# EAGLE design swarm-agg1 (EAGLE 4.16)
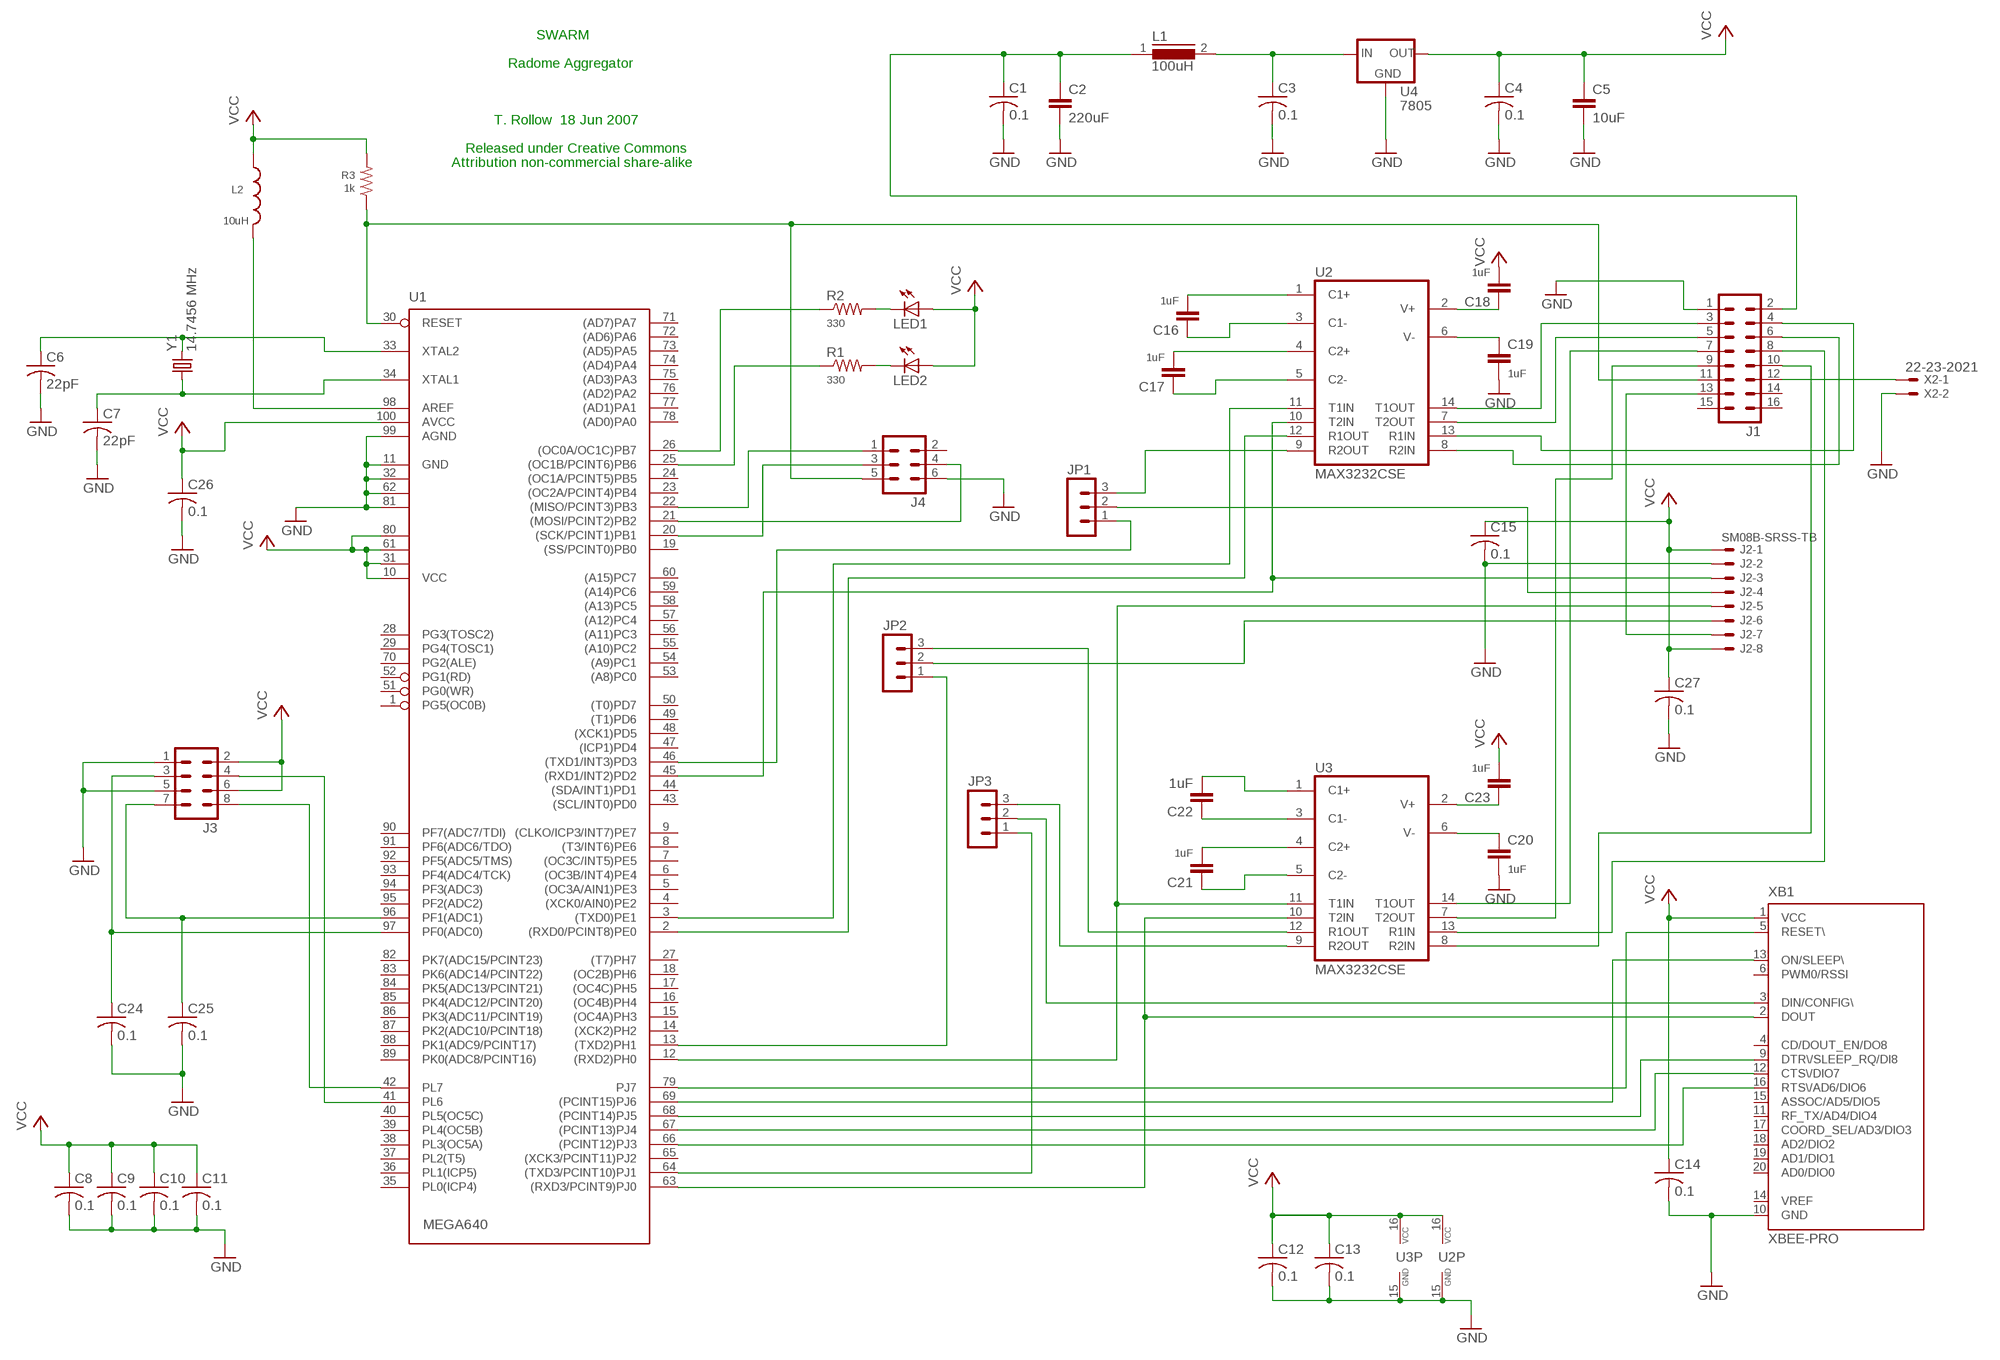
[diagram p0: schematic, sheet 1]

## Parts
C1  0.1  C-USC0805K  [C0805K]
C2  220uF  C2.5/5  [C2.5-5]
C3  0.1  C-USC0805K  [C0805K]
C4  0.1  C-USC0805K  [C0805K]
C5  10uF  C2.5/5  [C2.5-5]
C6  22pF  C-USC1206K  [C1206K]
C7  22pF  C-USC1206K  [C1206K]
C8  0.1  C-USC0805K  [C0805K]
C9  0.1  C-USC0805K  [C0805K]
C10  0.1  C-USC0805K  [C0805K]
C11  0.1  C-USC0805K  [C0805K]
C12  0.1  C-USC0805K  [C0805K]
C13  0.1  C-USC0805K  [C0805K]
C14  0.1  C-USC0805K  [C0805K]
C15  0.1  C-USC0805K  [C0805K]
C16  1uF  C-EUC1206  [C1206]
C17  1uF  C-EUC1206  [C1206]
C18  1uF  C-EUC1206  [C1206]
C19  1uF  C-EUC1206  [C1206]
C20  1uF  C-EUC1206  [C1206]
C21  1uF  C-EUC1206  [C1206]
C22  1uF  C-EUC1206  [C1206]
C23  1uF  C-EUC1206  [C1206]
C24  0.1  C-USC0805K  [C0805K]
C25  0.1  C-USC0805K  [C0805K]
C26  0.1  C-USC0805K  [C0805K]
C27  0.1  C-USC0805K  [C0805K]
J1  MA08-2  [MA08-2]
J2  SM08B-SRSS-TB  [SM08B-SRSS-TB]
J3  MA04-2  [MA04-2]
J4  MA03-2  [MA03-2]
JP1  MA03-1  [MA03-1]
JP2  MA03-1  [MA03-1]
JP3  MA03-1  [MA03-1]
L1  100uH  B82132  [SUKW2-22]
L2  10uH  L-USL1812  [L1812]
LED1  LEDSMT1206  [1206]
LED2  LEDSMT1206  [1206]
R1  330  R-US_M1206  [M1206]
R2  330  R-US_M1206  [M1206]
R3  1k  R-US_M1206  [M1206]
U1  MEGA640  [TQFP100]
U2  MAX3232CSE  [SO16]
U3  MAX3232CSE  [SO16]
U4  7805  78XXS  [78XXS]
X2  22-23-2021  [22-23-2021]
XB1  XBEE-PRO  [XBEE-PRO]
Y1  14.7456 MHz  CRYSTALHC49S  [HC49/S]

## Nets
GND: C1.2 C2.2 C3.2 C4.2 C5.2 C6.2 C7.2 C8.2 C9.2 C10.2 C11.2 C12.2 C13.2 C14.2 C15.2 C19.2 C20.2 C24.2 C25.2 C26.2 C27.2 J1.1 J2.2 J3.1 J3.5 J4.6 U1.11(GND) U1.32(GND1) U1.62(GND2) U1.81(GND3) U1.99(AGND) U2.15(GND) U3.15(GND) U4.GND X2.2 XB1.10(GND)
N$1: U1.3((TXD0)PE1) U2.11(T1IN)
N$3: C16.2 U2.1(C1+)
N$4: J1.3 U2.14(T1OUT)
N$5: J1.4 U2.13(R1IN)
N$6: J1.5 U2.7(T2OUT)
N$7: J1.6 U2.8(R2IN)
N$8: U1.2((RXD0/PCINT8)PE0) U2.12(R1OUT)
N$9: JP1.3 U2.9(R2OUT)
N$10: J2.3 U1.45((RXD1/INT2)PD2) U2.10(T2IN)
N$11: JP1.1 U1.46((TXD1/INT3)PD3)
N$12: J2.4 JP1.2
N$13: J1.7 U3.14(T1OUT)
N$14: J1.8 U3.13(R1IN)
N$15: J2.5 U1.12((RXD2)PH0) U3.11(T1IN)
N$16: C3.1 L1.2 U4.IN
N$17: C1.1 C2.1 J1.2 L1.1
N$18: C24.1 J3.3 U1.97(PF0(ADC0))
N$19: C25.1 J3.7 U1.96(PF1(ADC1))
N$20: J1.9 U3.7(T2OUT)
N$21: J1.10 U3.8(R2IN)
N$22: J2.6 JP2.2
N$23: JP2.3 U3.12(R1OUT)
N$24: JP3.3 U3.9(R2OUT)
N$25: U1.63((RXD3/PCINT9)PJ0) U3.10(T2IN) XB1.2(DOUT)
N$26: JP3.1 U1.64((TXD3/PCINT10)PJ1)
N$27: JP3.2 XB1.3(DIN/CONFIG\)
N$28: JP2.1 U1.13((TXD2)PH1)
N$29: C6.1 U1.33(XTAL2) Y1.2
N$30: J4.1 U1.22((MISO/PCINT3)PB3)
N$31: J4.3 U1.20((SCK/PCINT1)PB1)
N$32: J1.12 X2.1
N$33: J1.11 J4.5 R3.1 U1.30(RESET)
N$34: J4.4 U1.21((MOSI/PCINT2)PB2)
N$35: C7.1 U1.34(XTAL1) Y1.1
N$36: J3.4 U1.41(PL6)
N$37: J3.8 U1.42(PL7)
N$38: C16.1 U2.3(C1-)
N$39: C17.2 U2.4(C2+)
N$40: C17.1 U2.5(C2-)
N$41: C19.1 U2.6(V-)
N$42: C18.1 U2.2(V+)
N$43: C23.1 U3.2(V+)
N$44: C20.1 U3.6(V-)
N$45: C21.1 U3.5(C2-)
N$46: C21.2 U3.4(C2+)
N$47: C22.1 U3.3(C1-)
N$48: C22.2 U3.1(C1+)
N$49: L2.2 U1.98(AREF)
N$50: LED2.C R1.2
N$51: R1.1 U1.25((OC1B/PCINT6)PB6)
N$52: LED1.C R2.2
N$53: R2.1 U1.26((OC0A/OC1C)PB7)
N$54: U1.79(PJ7) XB1.5(RESET\)
N$55: U1.69((PCINT15)PJ6) XB1.13(ON/SLEEP\)
N$56: U1.68((PCINT14)PJ5) XB1.9(DTR\/SLEEP_RQ/DI8)
N$57: U1.67((PCINT13)PJ4) XB1.12(CTS\/DIO7)
N$58: U1.66((PCINT12)PJ3) XB1.16(RTS\/AD6/DIO6)
N$59: J1.13 J2.7
VCC: C4.1 C5.1 C8.1 C9.1 C10.1 C11.1 C12.1 C13.1 C14.1 C15.1 C18.2 C23.2 C26.1 C27.1 J2.1 J2.8 J3.2 J3.6 L2.1 LED1.A LED2.A R3.2 U1.10(VCC) U1.31(VCC1) U1.61(VCC2) U1.80(VCC3) U1.100(AVCC) U2.16(VCC) U3.16(VCC) U4.OUT XB1.1(VCC)
Unconnected: J1.14 J1.15 J1.16 J4.2 U1.1(PG5(OC0B)) U1.4((XCK0/AIN0)PE2) U1.5((OC3A/AIN1)PE3) U1.6((OC3B/INT4)PE4) U1.7((OC3C/INT5)PE5) U1.8((T3/INT6)PE6) U1.9((CLKO/ICP3/INT7)PE7) U1.14((XCK2)PH2) U1.15((OC4A)PH3) U1.16((OC4B)PH4) U1.17((OC4C)PH5) U1.18((OC2B)PH6) U1.19((SS/PCINT0)PB0) U1.23((OC2A/PCINT4)PB4) U1.24((OC1A/PCINT5)PB5) U1.27((T7)PH7) U1.28(PG3(TOSC2)) U1.29(PG4(TOSC1)) U1.35(PL0(ICP4)) U1.36(PL1(ICP5)) U1.37(PL2(T5)) U1.38(PL3(OC5A)) U1.39(PL4(OC5B)) U1.40(PL5(OC5C)) U1.43((SCL/INT0)PD0) U1.44((SDA/INT1)PD1) U1.47((ICP1)PD4) U1.48((XCK1)PD5) U1.49((T1)PD6) U1.50((T0)PD7) U1.51(PG0(WR)) U1.52(PG1(RD)) U1.53((A8)PC0) U1.54((A9)PC1) U1.55((A10)PC2) U1.56((A11)PC3) U1.57((A12)PC4) U1.58((A13)PC5) U1.59((A14)PC6) U1.60((A15)PC7) U1.65((XCK3/PCINT11)PJ2) U1.70(PG2(ALE)) U1.71((AD7)PA7) U1.72((AD6)PA6) U1.73((AD5)PA5) U1.74((AD4)PA4) U1.75((AD3)PA3) U1.76((AD2)PA2) U1.77((AD1)PA1) U1.78((AD0)PA0) U1.82(PK7(ADC15/PCINT23)) U1.83(PK6(ADC14/PCINT22)) U1.84(PK5(ADC13/PCINT21)) U1.85(PK4(ADC12/PCINT20)) U1.86(PK3(ADC11/PCINT19)) U1.87(PK2(ADC10/PCINT18)) U1.88(PK1(ADC9/PCINT17)) U1.89(PK0(ADC8/PCINT16)) U1.90(PF7(ADC7/TDI)) U1.91(PF6(ADC6/TDO)) U1.92(PF5(ADC5/TMS)) U1.93(PF4(ADC4/TCK)) U1.94(PF3(ADC3)) U1.95(PF2(ADC2)) XB1.4(CD/DOUT_EN/DO8) XB1.6(PWM0/RSSI) XB1.11(RF_TX/AD4/DIO4) XB1.14(VREF) XB1.15(ASSOC/AD5/DIO5) XB1.17(COORD_SEL/AD3/DIO3) XB1.18(AD2/DIO2) XB1.19(AD1/DIO1) XB1.20(AD0/DIO0)

## Notes on the sheet
- SWARM
- Radome Aggregator
- T. Rollow  18 Jun 2007
- Released under Creative Commons
- Attribution non-commercial share-alike

## Library data of the parts
C1 C3 C4 C6-C15 C24-C27 = rcl:C-US: CAPACITOR, American symbol
C2 C5 = capacitor-wima:C: CAPACITOR naming: grid - package width
C16-C23 = rcl:C-EU: CAPACITOR, European symbol
J1 = con-lstb:MA08-2: PIN HEADER
J2 = con-jst2:?M08B-SRSS-TB: Disconnectable Crimp style connector, 1.0mm pitch 8 contacts
J3 = con-lstb:MA04-2: PIN HEADER
J4 = con-lstb:MA03-2: PIN HEADER
JP1-JP3 = con-lstb:MA03-1: PIN HEADER
L1 = inductors:B82132: INDUCTOR
L2 = rcl:L-US: INDUCTOR, American symbol
LED1 LED2 = led:LED: LED OSRAM: - CHIPLED LG R971, LG N971, LY N971, LG Q971, LY Q971, LO R971, LY R971 LH N974, LH R974 LS Q976, LO Q976, LY Q976 LO Q996 - Hyper CHIPLED LW Q18S LB Q993, LB Q99A, LB R99A - SideLED LS A670, LO A670, LY A670, LG A670, LP A670 LB A673, LV A673, LT A673, LW A673 LH A674 LY A675 LS A676, LA A676, LO A676, LY A676, LW A676 LS A679, LY A679, LG A679 - Hyper Micro SIDELED® LS Y876, LA Y876, LO Y876, LY Y876 LT Y87S - SmartLED LW L88C, LW L88S LB L89C, LB L89S, LG L890 LS L89K, LO L89K, LY L89K LS L896, LA L896, LO L896, LY L896 - TOPLED LS T670, LO T670, LY T670, LG T670, LP T670 LSG T670, LSP T670, LSY T670, LOP T670, LYG T670 LG T671, LOG T671, LSG T671 LB T673, LV T673, LT T673, LW T673 LH T674 LS T676, LA T676, LO T676, LY T676, LB T676, LH T676, LSB T676, LW T676 LB T67C, LV T67C, LT T67C, LS T67K, LO T67K, LY T67K, LW E67C LS E67B, LA E67B, LO E67B, LY E67B, LB E67C, LV E67C, LT E67C LW T67C LS T679, LY T679, LG T679 LS T770, LO T770, LY T770, LG T770, LP T770 LB T773, LV T773, LT T773, LW T773 LH T774 LS E675, LA E675, LY E675, LS T675 LS T776, LA T776, LO T776, LY T776, LB T776 LHGB T686 LT T68C, LB T68C - Hyper Mini TOPLED® LB M676 - Mini TOPLED Santana® LG M470 LS M47K, LO M47K, LY M47K Source: http://www.osram.convergy.de - LUMILED® LXK2-PW12-R00, LXK2-PW12-S00, LXK2-PW14-U00, LXK2-PW14-V00 LXK2-PM12-R00, LXK2-PM12-S00, LXK2-PM14-U00 LXK2-PE12-Q00, LXK2-PE12-R00, LXK2-PE12-S00, LXK2-PE14-T00, LXK2-PE14-U00 LXK2-PB12-K00, LXK2-PB12-L00, LXK2-PB12-M00, LXK2-PB14-N00, LXK2-PB14-P00, LXK2-PB14-Q00 LXK2-PR12-L00, LXK2-PR12-M00, LXK2-PR14-Q00, LXK2-PR14-R00 LXK2-PD12-Q00, LXK2-PD12-R00, LXK2-PD12-S00 LXK2-PH12-R00, LXK2-PH12-S00 LXK2-PL12-P00, LXK2-PL12-Q00, LXK2-PL12-R00 Source: www.luxeon.com
R1-R3 = rcl:R-US_: RESISTOR, American symbol
U1 = atmel-tad:MEGA640
U2 U3 = maxim:MAX3232*: True RS-232 Transceivers 3.0V to 5.5V, Low-Power up to 1Mbps, Using Four 0.1µF External Capacitors Source: http://pdfserv.maxim-ic.com/en/ds/MAX3222-MAX3241.pdf
U4 = v-reg:78XXS: VOLTAGE REGULATOR
X2 = con-molex:22-23-2021: .100" (2.54mm) Center Header - 2 Pin
XB1 = maxstream:XBEE: XBee (TM) /XBee-PRO(TM) OEM RF Modules Source: MaxStream, Inc. xbee_productmanual.pdf
Y1 = crystal:CRYSTAL: CRYSTAL

## Board
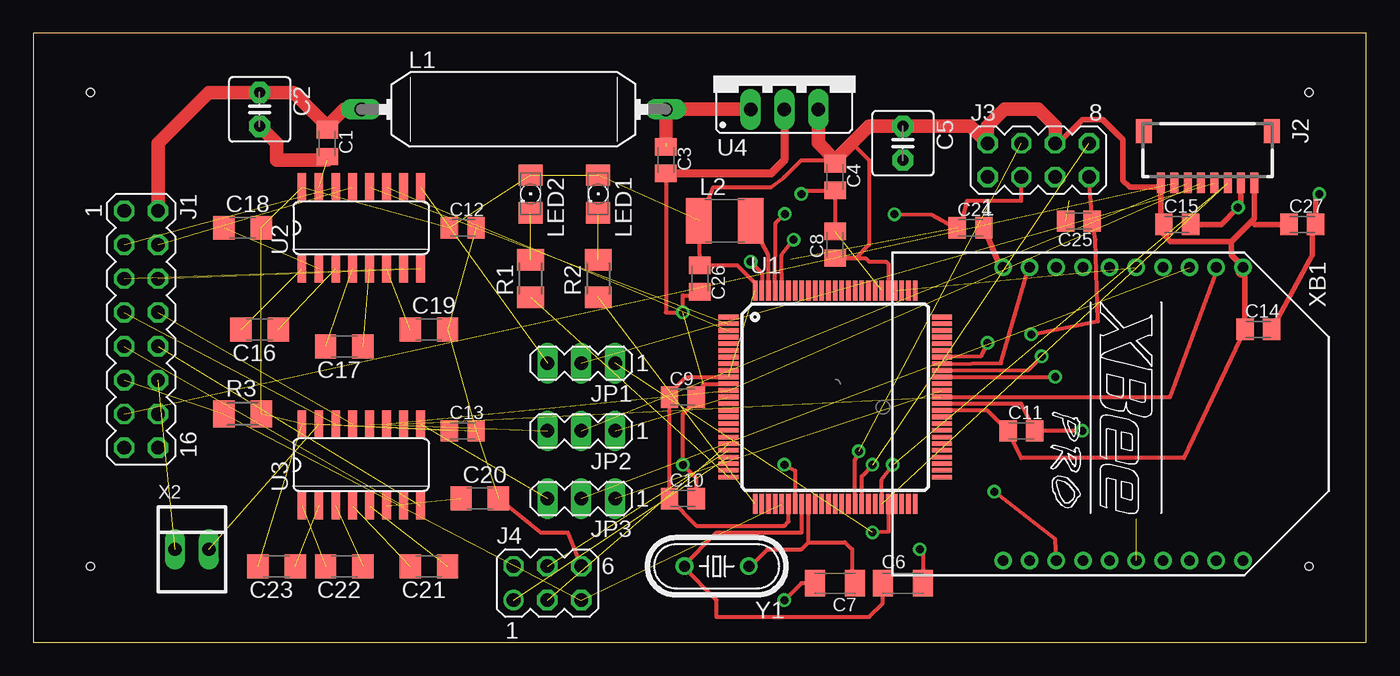
[diagram p1: board, top side]
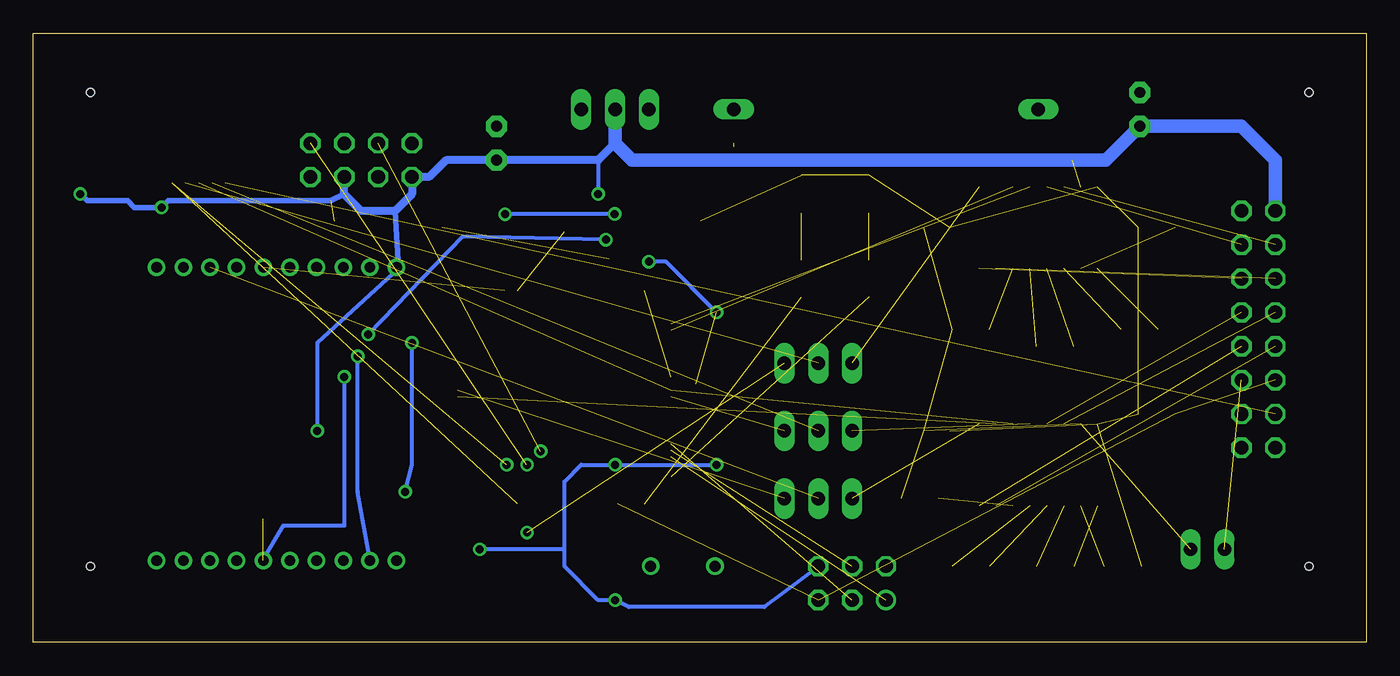
[diagram p2: board, bottom side, seen from below]

Size 100 x 45.71 mm. Coordinates in mm from the lower left corner, seen from the top.
Outline: 0,0 100,0 100,45.71 0,45.71 0,0
Copper layers (1*16): Top 0.035mm / dielectric 1.5mm / Bottom 0.035mm
Design rules "default": minimum track width 10mil, minimum drill 24mil, track to track 8mil, track to pad 8mil, pad to pad 8mil, via to via 8mil, smd to smd 8mil, copper to edge 40mil, drill to drill 8mil, minimum pad ring 10mil, minimum via ring 8mil, stop-mask expansion 4mil, vias tented up to drill 0mil, thermal gap 10mil
Holes 0.6 mm at 4.28,5.71 4.28,41.27 95.72,41.27 95.72,5.71

### Footprints (pad centres in the part's own frame; a part is rotated, then mirrored left to right if it is on the bottom)
C0805K = smd 1.3 x 1.6: 1 -1,0; 2 1,0
C2.5-5 = drill 0.813 pad 1.6 octagon: 1 -1.27,0; 2 1.27,0
C1206K = smd 1.5 x 2: 1 -1.5,0; 2 1.5,0
C1206 = smd 1.6 x 1.8: 1 -1.4,0; 2 1.4,0
MA08-2 = drill 1.016 octagon: 1 -8.89,-1.27; 2 -8.89,1.27; 3 -6.35,-1.27; 4 -6.35,1.27; 5 -3.81,-1.27; 6 -3.81,1.27; 7 -1.27,-1.27; 8 -1.27,1.27; 9 1.27,-1.27; 10 1.27,1.27; 11 3.81,-1.27; 12 3.81,1.27; 13 6.35,-1.27; 14 6.35,1.27; 15 8.89,-1.27; 16 8.89,1.27
SM08B-SRSS-TB = smd 0.6 x 1.55: 1 -3.5,2.975; 2 -2.5,2.975; 3 -1.5,2.975; 4 -0.5,2.975; 5 0.5,2.975; 6 1.5,2.975; 7 2.5,2.975; 8 3.5,2.975 | smd 1.2 x 1.8: FIT@1 -4.8,-0.9; FIT@2 4.8,-0.9
MA04-2 = drill 1.016 octagon: 1 -3.81,-1.27; 2 -3.81,1.27; 3 -1.27,-1.27; 4 -1.27,1.27; 5 1.27,-1.27; 6 1.27,1.27; 7 3.81,-1.27; 8 3.81,1.27
MA03-2 = drill 1.016 round: 1 -2.54,-1.27 | drill 1.016 octagon: 2 -2.54,1.27; 3 0,-1.27; 4 0,1.27; 5 2.54,-1.27; 6 2.54,1.27
MA03-1 = drill 1.016 long: 1 -2.54,0; 2 0,0; 3 2.54,0
SUKW2-22 = drill 1.016 long: 1 -11.43,0; 2 11.43,0
L1812 = smd 1.9 x 3.4: 1 -1.95,0; 2 1.95,0
1206 = smd 1.6 x 1.803: A -1.422,0; C 1.422,0
M1206 = smd 1.6 x 2: 1 -1.4,0; 2 1.4,0
TQFP100 = smd 1.5 x 0.35: 1 -8,6; 2 -8,5.5; 3 -8,5; 4 -8,4.5; 5 -8,4; 6 -8,3.5; 7 -8,3; 8 -8,2.5; 9 -8,2; 10 -8,1.5; 11 -8,1; 12 -8,0.5; 13 -8,0; 14 -8,-0.5; 15 -8,-1; 16 -8,-1.5; 17 -8,-2; 18 -8,-2.5; 19 -8,-3; 20 -8,-3.5; 21 -8,-4; 22 -8,-4.5; 23 -8,-5; 24 -8,-5.5; 25 -8,-6; 51 8,-6; 52 8,-5.5; 53 8,-5; 54 8,-4.5; 55 8,-4; 56 8,-3.5; 57 8,-3; 58 8,-2.5; 59 8,-2; 60 8,-1.5; 61 8,-1; 62 8,-0.5; 63 8,0; 64 8,0.5; 65 8,1; 66 8,1.5; 67 8,2; 68 8,2.5; 69 8,3; 70 8,3.5; 71 8,4; 72 8,4.5; 73 8,5; 74 8,5.5; 75 8,6 | smd 0.35 x 1.5: 26 -6,-8; 27 -5.5,-8; 28 -5,-8; 29 -4.5,-8; 30 -4,-8; 31 -3.5,-8; 32 -3,-8; 33 -2.5,-8; 34 -2,-8; 35 -1.5,-8; 36 -1,-8; 37 -0.5,-8; 38 0,-8; 39 0.5,-8; 40 1,-8; 41 1.5,-8; 42 2,-8; 43 2.5,-8; 44 3,-8; 45 3.5,-8; 46 4,-8; 47 4.5,-8; 48 5,-8; 49 5.5,-8; 50 6,-8; 76 6,8; 77 5.5,8; 78 5,8; 79 4.5,8; 80 4,8; 81 3.5,8; 82 3,8; 83 2.5,8; 84 2,8; 85 1.5,8; 86 1,8; 87 0.5,8; 88 0,8; 89 -0.5,8; 90 -1,8; 91 -1.5,8; 92 -2,8; 93 -2.5,8; 94 -3,8; 95 -3.5,8; 96 -4,8; 97 -4.5,8; 98 -5,8; 99 -5.5,8; 100 -6,8
SO16 = smd 0.66 x 2.032: 1 -4.445,-3.073; 2 -3.175,-3.073; 3 -1.905,-3.073; 4 -0.635,-3.073; 5 0.635,-3.073; 6 1.905,-3.073; 7 3.175,-3.073; 8 4.445,-3.073; 9 4.445,3.073; 10 3.175,3.073; 11 1.905,3.073; 12 0.635,3.073; 13 -0.635,3.073; 14 -1.905,3.073; 15 -3.175,3.073; 16 -4.445,3.073
78XXS = drill 1.016 long: GND 0,-2.54; IN -2.54,-2.54; OUT 2.54,-2.54
22-23-2021 = drill 1 long: 1 -1.27,0; 2 1.27,0
XBEE-PRO = drill 0.8 pad 1.27 round: 1 -11,9; 2 -11,7; 3 -11,5; 4 -11,3; 5 -11,1; 6 -11,-1; 7 -11,-3; 8 -11,-5; 9 -11,-7; 10 -11,-9; 11 11,-9; 12 11,-7; 13 11,-5; 14 11,-3; 15 11,-1; 16 11,1; 17 11,3; 18 11,5; 19 11,7; 20 11,9
HC49/S = drill 0.813 round: 1 -2.413,0; 2 2.413,0

### Placement (x,y rotation side)
C1  22.06,37.46 270 top
C2  16.98,40 270 top
C3  47.46,36.19 270 top
C4  60.16,34.92 270 top
C5  65.24,37.46 270 top
C6  65.24,4.44 0 top
C7  60.16,4.44 180 top
C8  60.16,29.84 90 top
C9  48.73,18.41 0 top
C10  48.73,10.79 0 top
C11  74.13,15.87 0 top
C12  32.22,31.11 0 top
C13  32.22,15.87 0 top
C14  91.91,23.49 0 top
C15  85.81,31.36 0 top
C16  16.98,23.49 180 top
C17  23.33,22.22 180 top
C18  15.71,31.11 0 top
C19  29.68,23.49 0 top
C20  33.49,10.79 0 top
C21  29.68,5.71 180 top
C22  23.33,5.71 180 top
C23  18.25,5.71 180 top
C24  70.32,31.11 0 top
C25  78.45,31.62 180 top
C26  50,27.3 270 top
C27  95.21,31.36 0 top
J1  8.09,23.49 270 top
J2  88.1,37.46 180 top
J3  75.4,36.19 0 top
J4  38.57,4.44 0 top
JP1  41.11,20.95 180 top
JP2  41.11,15.87 180 top
JP3  41.11,10.79 180 top
L1  36.03,40 0 top
L2  51.88,31.64 0 top
LED1  42.38,33.65 270 top
LED2  37.3,33.65 270 top
R1  37.3,27.3 90 top
R2  42.38,27.3 90 top
R3  15.71,17.14 0 top
U1  60.16,18.41 0 top
U2  24.6,31.11 0 top
U3  24.6,13.33 0 top
U4  56.35,42.54 0 top
X2  11.9,6.98 0 top
XB1  81.75,17.14 270 top
Y1  51.27,5.71 180 top

### Tracks (layer width: path | path; a pad name or v marks a point on that pad's centre or on a via)
GND  (via drill 0.6)  (11 unrouted)
  Top 0.305: U1.99 54.66,27.72 v53.81,28.57 | C26.2 50,26.03 48.73,26.03 v48.73,24.76 47.46,24.76 C3.2 | C8.2 C4.2 57.89,33.92 v57.62,33.65 | C7.2 57.62,4.44 56.35,3.17 | C6.2 66.74,6.75 v66.51,6.98 | U1.32 57.16,12.87 v56.35,13.33 | C10.2 49.73,12.33 v48.73,13.33 48.73,17.14 50,18.41 | U1.11 50.27,19.41 50,18.41 | 50,18.41 C9.2 | U1.62 74.13,17.9 75.15,15.87 C11.2 v78.7,15.87 | C20.2 38.06,8.25 40.09,8.25 J4.6
  Top 0.406: J2.2 90.6,32.85 v90.39,32.63 89.12,31.36 C15.2 | v96.48,33.65 96.21,33.38 C27.2 95.97,31.11 95.97,29.08 C14.2 | 72.61,28.06 C24.2
  Top 0.61: U4.GND 56.35,36.19 55.35,35.19 C3.2
  Top 1.016: C2.2 18.25,37.46 18.25,36.19 22.06,36.19 C1.2
  Bottom 0.305: v53.81,28.57 52.54,28.57 v48.73,24.76 | 57.62,36.19 v57.62,33.65 | 60.16,6.98 60.16,5.71 57.62,3.17 56.35,3.17 55.33,2.66 45.17,2.66 J4.6 | 60.16,6.98 60.16,12.06 58.89,13.33 v56.35,13.33 v48.73,13.33 | 60.16,6.98 v66.51,6.98 | v78.7,15.87 78.7,22.47 72.61,28.06
  Bottom 0.406: v96.48,33.65 95.97,33.14 92.93,33.14 92.42,32.63 v90.39,32.63 89.88,33.14 77.69,33.14 76.67,33.65 | XB1.10 72.61,28.06 72.86,32.38
  Bottom 0.61: 56.35,37.46 57.62,36.19 C5.2 69.05,36.19 70.32,34.92 J3.1 71.59,33.65 72.86,32.38 75.4,32.38 76.67,33.65 J3.5
  Bottom 1.016: J1.1 6.82,36.19 9.36,38.73 C2.2 19.52,36.19 55.08,36.19 56.35,37.46 U4.GND
N$1  (1 unrouted)
N$2  (via drill 0.6)
  other vias: 48.73,24.76
N$3  (1 unrouted)
N$4  (1 unrouted)
N$5  (1 unrouted)
N$6  (1 unrouted)
N$7  (1 unrouted)
N$8  (1 unrouted)
N$9  (1 unrouted)
N$10  (2 unrouted)
  Top 0.305: U1.45 63.64,12.19 64.48,13.33
N$11  (1 unrouted)
  Top 0.305: U1.46 64.17,8.3 62.95,8.25
N$12  (1 unrouted)
N$13  (1 unrouted)
N$14  (1 unrouted)
N$15  (2 unrouted)
N$16  (1 unrouted)
  Top 1.016: U4.IN L1.2 47.46,37.46
N$17
  Top 1.016: J1.2 9.36,37.46 13.17,41.27 C2.1 19.52,41.27 22.06,38.73 | C1.1 22.06,38.73 | 22.06,38.73 23.33,40 L1.1
N$18  (via drill 0.6)  (2 unrouted)
  Top 0.305: J3.3 74.13,33.14 70.07,33.14 69.56,31.11 C24.1 69.3,31.06 67.4,32.1 v64.61,32.13 | U1.97 55.69,31.47 v56.38,32.15
  Bottom 0.305: v56.38,32.15 v64.61,32.13
N$19  (via drill 0.6)
  Top 0.305: U1.96 56.15,29.05 v57.04,30.22 | J3.7 79.46,31.64 C25.1 79.69,30.2 79.87,24.1 v74.87,23.11
  Bottom 0.305: v74.87,23.11 67.78,30.45 57.04,30.25 v57.04,30.22
N$20  (1 unrouted)
N$21  (1 unrouted)
N$22  (1 unrouted)
N$23  (1 unrouted)
N$24  (1 unrouted)
N$25  (1 unrouted)
  Top 0.305: U1.63 85.31,18.41 88.86,28.06 XB1.2
N$26  (1 unrouted)
N$27  (1 unrouted)
N$28  (1 unrouted)
N$29
  Top 0.305: U1.33 57.66,8.29 57.62,8.25 51.27,8.25 48.73,5.71 | C6.1 63.74,2.94 62.7,1.9 51.27,1.9 51.27,3.17 48.73,5.71 | 48.73,5.71 Y1.2
N$30  (1 unrouted)
N$31  (1 unrouted)
N$32  (1 unrouted)
N$33  (3 unrouted)
N$34  (1 unrouted)
N$35
  Top 0.305: 58.16,7.52 U1.34 | 58.16,7.52 57.62,6.98 55.08,6.98 53.81,5.71 Y1.1 | 58.16,7.52 60.89,7.52 61.43,6.98 61.43,4.44 C7.1
N$36  (via drill 0.6)  (1 unrouted)
  Top 0.305: U1.41 61.66,13.66 v61.94,14.35
N$37  (1 unrouted)
  Top 0.305: U1.42 62.17,12.47 62.98,13.33
N$38  (1 unrouted)
N$39  (1 unrouted)
N$40  (1 unrouted)
N$41  (1 unrouted)
N$42  (1 unrouted)
N$43  (1 unrouted)
N$44  (1 unrouted)
N$45  (1 unrouted)
N$46  (1 unrouted)
N$47  (1 unrouted)
N$48  (1 unrouted)
N$49
  Top 0.305: U1.98 55.16,29.05 53.81,31.57 L2.2
N$50  (1 unrouted)
N$51  (1 unrouted)
N$52  (1 unrouted)
N$53  (1 unrouted)
N$54  (1 unrouted)
N$55  (via drill 0.6)
  Top 0.305: U1.69 71.08,21.46 v71.59,22.47 | XB1.13 76.67,7.74 v72.1,11.3
  Bottom 0.305: v72.1,11.3 71.59,13.33 v71.59,22.47
N$56
  Top 0.305: U1.68 72.61,20.95 74.64,28.06 XB1.9
N$57  (via drill 0.6)
  Top 0.305: U1.67 74.64,20.44 v75.65,21.46
  Bottom 0.305: XB1.12 75.65,11.3 v75.65,21.46
N$58  (via drill 0.6)  (1 unrouted)
  Top 0.305: U1.66 v76.67,19.93
  Bottom 0.305: v76.67,19.93 76.67,8.76 81.24,8.76 82.77,6.22 XB1.16
N$59  (1 unrouted)
N$60  (via drill 0.6)
  other vias: 57.62,33.65
N$61  (via drill 0.6)
  other vias: 56.35,3.17
N$62  (via drill 0.6)
  other vias: 66.51,6.98
N$63  (via drill 0.6)
  other vias: 56.35,13.33
N$64  (via drill 0.6)
  other vias: 48.73,13.33
N$65  (via drill 0.6)
  other vias: 62.95,13.33
N$66  (via drill 0.6)
  other vias: 64.48,13.33
N$67  (via drill 0.6)
  other vias: 62.95,8.25
VCC  (10 unrouted)
  Top 0.305: U1.100 54.16,26.95 52.81,28.3 C26.1 50,28.32 L2.1 50,31.62 51.02,34.16 55.33,34.16 56.35,34.92 57.62,36.19 60.16,36.19 | 61.43,37.46 62.7,36.19 62.7,29.84 61.7,28.84 C8.1 62.43,28.84 62.7,28.57 63.97,28.57 64.16,28.38 U1.80 | U1.10 48.96,19.91 47.46,18.41 47.71,18.41 | U1.31 56.66,9.07 56.35,8.76 49.75,8.76 47.71,10.79 C10.1 47.73,18.39 47.71,18.41 | 47.71,18.41 C9.1 | U1.61 71.59,17.39 73.11,15.87 | C14.1 86.32,13.84 74.13,13.84 73.11,15.87 | 73.11,15.87 C11.1
  Top 0.406: J3.6 76.92,37.46 78.7,39.24 80.23,39.24 81.75,37.71 81.75,34.67 82.26,34.16 84.29,34.16 84.62,34.48 J2.8 84.6,31.82 84.81,31.6 C15.1 84.81,30.59 85.31,30.09 89.88,30.09 | 90.82,28.14 90.89,28.06 | 90.82,28.14 XB1.1 arc327 90.89,28.06 | 89.88,30.09 89.88,29.08 90.82,28.14 | J2.1 91.6,31.82 91.4,31.62 | 89.88,30.09 91.4,31.62 | C27.1 91.66,31.36 91.4,31.62 | 90.89,28.06 C14.1
  Top 1.016: U4.OUT 58.89,37.46 60.16,36.19 | 60.16,36.19 C4.1 | 60.16,36.19 61.43,37.46 62.7,38.73 C5.1 70.32,38.73 J3.2 71.59,38.73 72.86,40 75.4,40 76.67,38.73 J3.6